# EAGLE design Due VGA Shield (EAGLE 6.1)
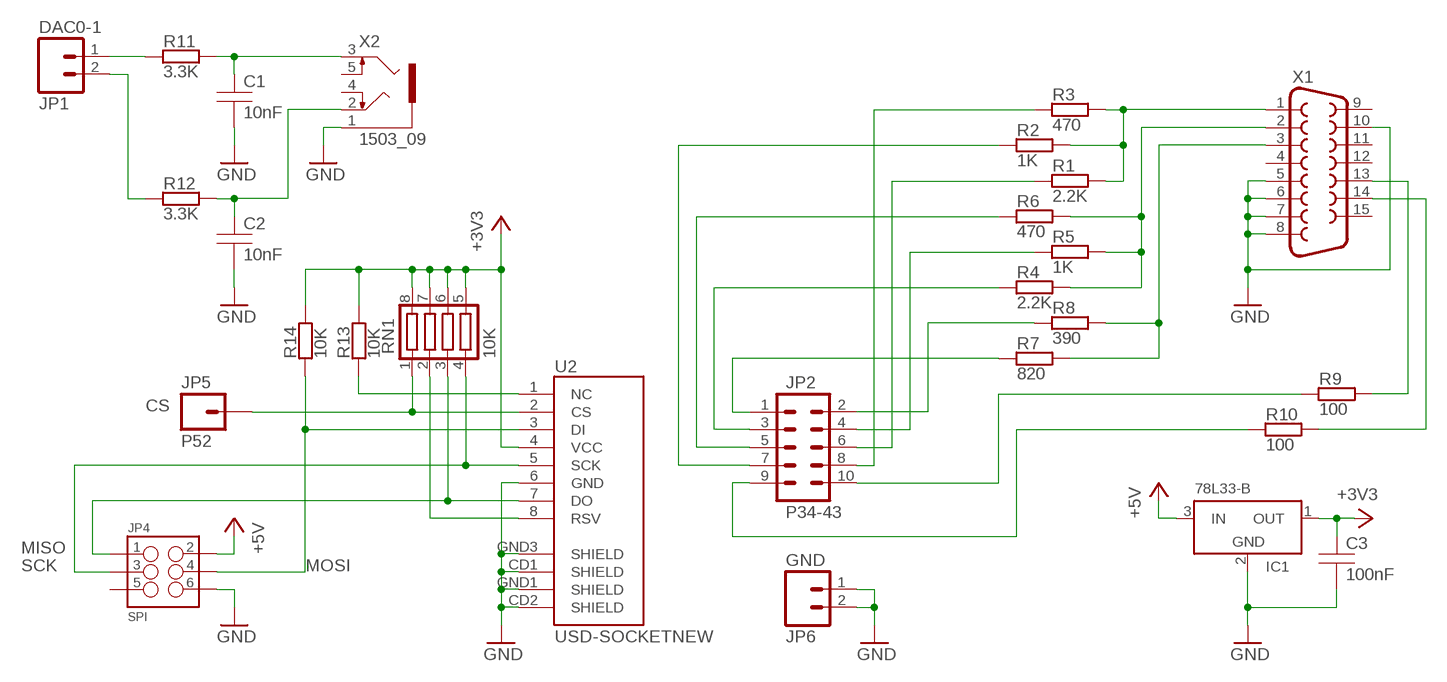
[diagram p0: schematic, sheet 1]

## Parts
C1  10nF  CAPACITOR_CERAM-SMD-2012  [SMD-2012]
C2  10nF  CAPACITOR_CERAM-SMD-2012  [SMD-2012]
C3  100nF  CAPACITOR_CERAM-SMD-2012  [SMD-2012]
IC1  78L33-B  [TO-92/M]
JP1  DAC0-1  M02PTH  [1X02]
JP2  P34-43  M05X2PTH  [AVR_ICSP]
JP4  SPI  M03X22X3_SILK_SM  [2X3]
JP5  P52  M01PTH  [1X01]
JP6  GND  M02PTH  [1X02]
R1  2.2K  RESISTENCIA-SMD-2012  [SMD-2012]
R2  1K  RESISTENCIA-SMD-2012  [SMD-2012]
R3  470  RESISTENCIA-SMD-2012  [SMD-2012]
R4  2.2K  RESISTENCIA-SMD-2012  [SMD-2012]
R5  1K  RESISTENCIA-SMD-2012  [SMD-2012]
R6  470  RESISTENCIA-SMD-2012  [SMD-2012]
R7  820  RESISTENCIA-SMD-2012  [SMD-2012]
R8  390  RESISTENCIA-SMD-2012  [SMD-2012]
R9  100  RESISTENCIA-SMD-2012  [SMD-2012]
R10  100  RESISTENCIA-SMD-2012  [SMD-2012]
R11  3.3K  RESISTENCIA-SMD-2012  [SMD-2012]
R12  3.3K  RESISTENCIA-SMD-2012  [SMD-2012]
R13  10K  RESISTENCIA-SMD-2012  [SMD-2012]
R14  10K  RESISTENCIA-SMD-2012  [SMD-2012]
RN1  10K  CTS742C083  [CTS742C083]
U2  USD-SOCKETNEW  [MICRO-SD-SOCKET-PP]
X1  F15HDH  [HDF15H]
X2  1503_09  [1503_09]

## Nets
+3V3: C3.P$1 IC1.1(OUT) R13.P$1 R14.P$1 RN1.5 RN1.6 RN1.7 RN1.8 U2.4(VCC)
+5V: IC1.3(IN) JP4.2
CS: JP5.1 RN1.1 U2.2(CS)
GND: C1.P$2 C2.P$2 C3.P$2 IC1.2(GND) JP4.6 JP6.1 JP6.2 U2.6(GND) U2.CD1(SHIELD) U2.CD2(SHIELD) U2.GND1(SHIELD) U2.GND3(SHIELD) X1.5 X1.6 X1.7 X1.8 X1.10 X2.1
MISO: JP4.1 RN1.3 U2.7(DO)
MOSI: JP4.4 R14.P$2 U2.3(DI)
N$1: R9.P$1 X1.13
N$2: R10.P$1 X1.14
N$3: R1.P$1 R2.P$1 R3.P$1 X1.1
N$4: R4.P$1 R5.P$1 R6.P$1 X1.2
N$5: R7.P$1 R8.P$1 X1.3
N$6: C1.P$1 R11.P$1 X2.3
N$7: C2.P$1 R12.P$1 X2.2
N$8: JP2.1 R7.P$2
N$9: JP2.2 R8.P$2
N$10: JP2.3 R4.P$2
N$11: JP2.4 R5.P$2
N$12: JP2.5 R6.P$2
N$13: JP2.6 R1.P$2
N$14: JP2.7 R2.P$2
N$15: JP2.8 R3.P$2
N$16: JP1.1 R11.P$2
N$17: JP1.2 R12.P$2
N$18: JP2.9 R10.P$2
N$19: JP2.10 R9.P$2
N$26: RN1.2 U2.8(RSV)
N$27: R13.P$2 U2.1(NC)
SCK: JP4.3 RN1.4 U2.5(SCK)
Unconnected: JP4.5 X1.4 X1.9 X1.11 X1.12 X1.15 X2.4 X2.5

## Library data of the parts
C1-C3 = Personal - Varios:CAPACITOR_CERAM
IC1 = Personal - Semiconductores:78L33
JP1 JP6 = SparkFun-Connectors:M02: Standard 2-pin 0.1" header. Use with - straight break away headers ( PRT-00116) - right angle break away headers (PRT-00553) - swiss pins (PRT-00743) - machine pins (PRT-00117) - female headers (PRT-00115) Molex polarized connector foot print use with: PRT-08233 with associated crimp pins and housings. 2.54_SCREWTERM for use with PRT-10571. 3.5mm Screw Terminal footprints for PRT-08084 5mm Screw Terminal footprints for use with PRT-08433
JP2 = SparkFun-Connectors:M05X2: Header 5x2 Standard 10-pin dual row 0.1" header. Commonly used with AVR-ISP. Use with Spark Fun Electronics SKU: PRT-00778
JP4 = SparkFun-Connectors:M03X2: 2x3 .1" header. Shrouded, with keying- CONN-10681 SMT- CONN-11415 Pogo pins- HW-11044
JP5 = SparkFun-Connectors:M01: Header 1 Standard 1-pin 0.1" header. Use with straight break away headers (SKU : PRT-00116), right angle break away headers (PRT-00553), swiss pins (PRT-00743), machine pins (PRT-00117), and female headers (PRT-00115).
R1-R14 = Personal - Varios:RESISTENCIA
RN1 = resistor-net:CTS742C083: Chip Resistor Array 4 Single Resistor Source: http://www.ctscorp.com/components/Datasheets/CTSChipArrayDs.pdf; OC_FARNELL: unknown; OC_NEWARK: unknown
U2 = SparkFun-Connectors:USD-SOCKET: microSD Socket Push-push type uSD socket. Schematic element and footprint production proven. Spark Fun Electronics SKU : PRT-00127. tDoc lines correctly indicate media card edge positions when inserting (unlocked, locked, depressed).
X1 = con-subd:F15: SUB-D; OC_FARNELL: unknown; OC_NEWARK: unknown
X2 = con-lumberg:1503_09: Jack connectors according to JISC 6560, 3.5 mm Klinkeneinbaukupplung nach JISC 6560, 3,5 mm, 3-polig/ stereo, abgewinkelte Ausführung, mit 2 Öffnern und Lötaugen, für Leiterplatten Rückseitenmontage Source: http://www.lumberg.com/Produkte/PDFs/1503_09.pdf; OC_FARNELL: 1243244; OC_NEWARK: unknown

## Board
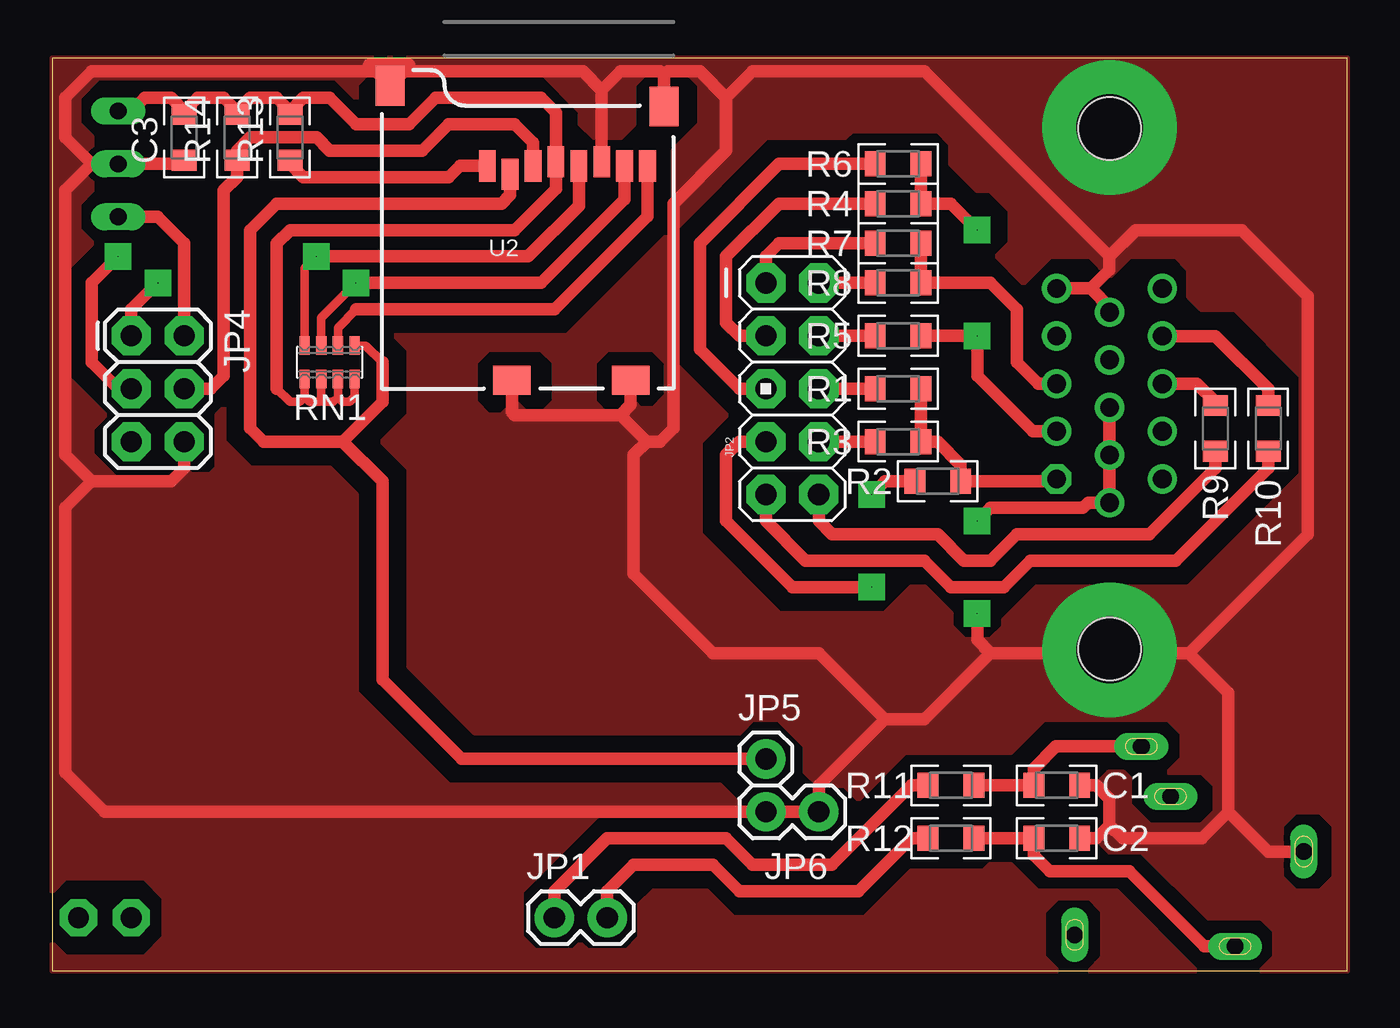
[diagram p1: board, top side]
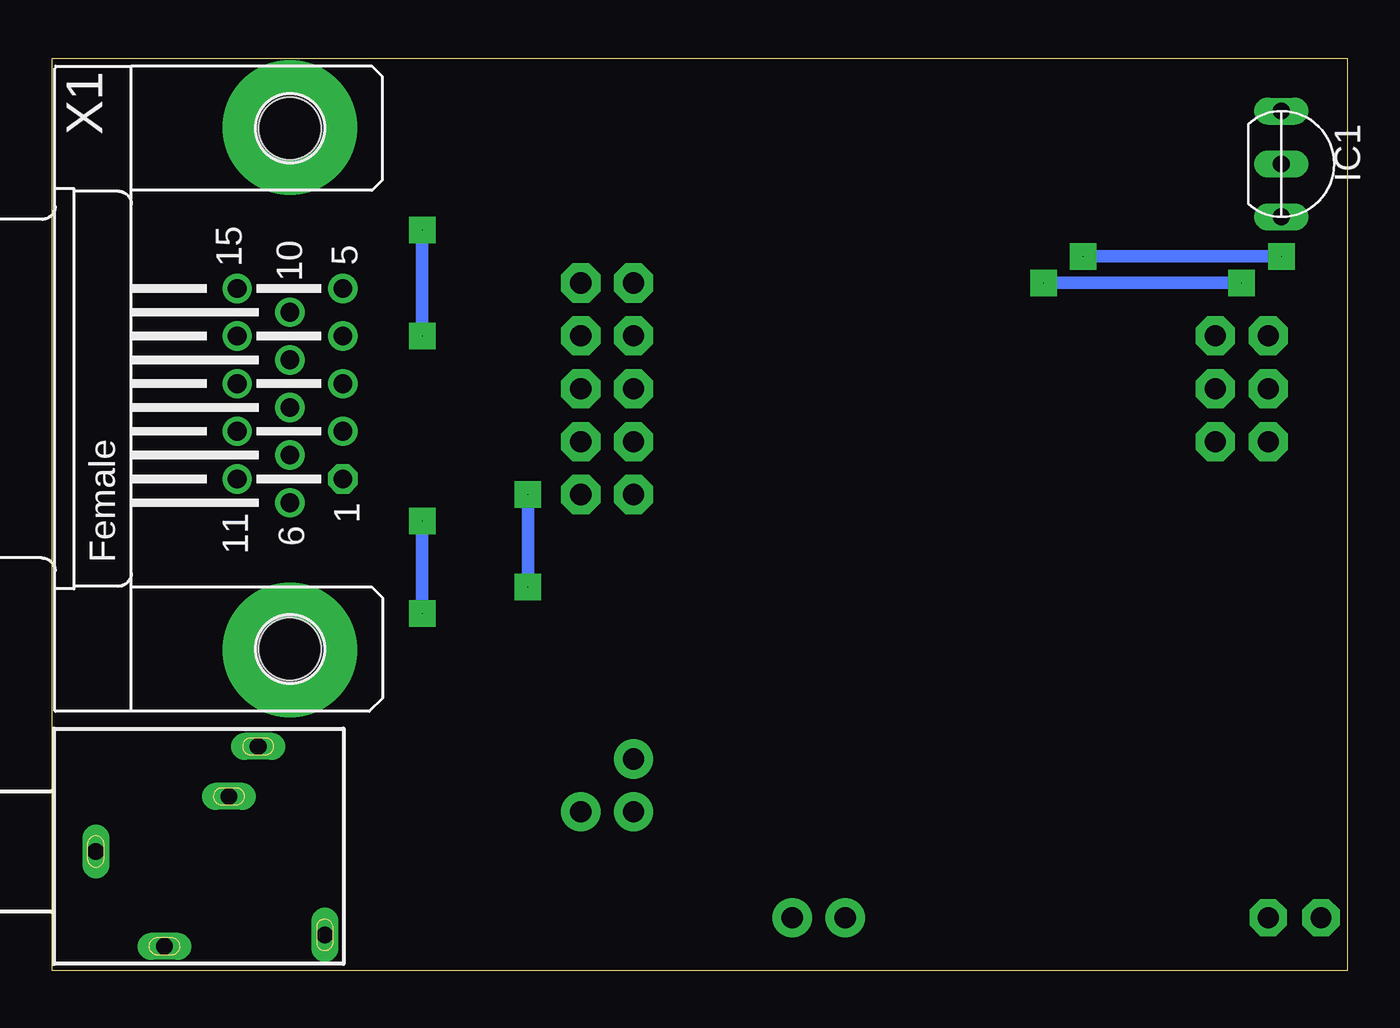
[diagram p2: board, bottom side, seen from below]

Size 62.23 x 43.81 mm. Coordinates in mm from the lower left corner, seen from the top.
Outline: 0,0 62.23,0 62.23,43.81 0,43.81 0,0
Copper layers (1*16): Top 0.035mm / dielectric 1.5mm / Bottom 0.035mm
Design rules: minimum track width 16mil, minimum drill 1mil, track to track 11mil, track to pad 11mil, pad to pad 11mil, via to via 11mil, smd to smd 11mil, copper to edge 0mil, drill to drill 8mil, minimum pad ring 10mil, minimum via ring 8mil, stop-mask expansion 4mil, vias tented up to drill 0mil, thermal gap 12mil

### Footprints (pad centres in the part's own frame; a part is rotated, then mirrored left to right if it is on the bottom)
SMD-2012 = smd 1 x 1.2: P$1 1.1,0; P$2 -1.1,0
TO-92/M = drill 0.8 long: 1 -2.54,0; 2 0,0; 3 2.54,0
1X02 = drill 1.016 pad 1.88: 1 0,0; 2 2.54,0
AVR_ICSP = drill 1.016 pad 1.88 octagon: 1 -1.27,5.08; 2 1.27,5.08; 3 -1.27,2.54; 4 1.27,2.54; 5 -1.27,0; 6 1.27,0; 7 -1.27,-2.54; 8 1.27,-2.54; 9 -1.27,-5.08; 10 1.27,-5.08
2X3 = drill 1.016 pad 1.88 octagon: 1 0,0; 2 0,2.54; 3 2.54,0; 4 2.54,2.54; 5 5.08,0; 6 5.08,2.54
1X01 = drill 1.016 pad 1.88: 1 0,0
CTS742C083 = smd 0.5 x 0.9: 1 -1.2,-0.8; 2 -0.4,-0.8; 3 0.4,-0.8; 4 1.2,-0.8; 5 1.2,0.8; 6 0.4,0.8; 7 -0.4,0.8; 8 -1.2,0.8
MICRO-SD-SOCKET-PP = smd 0.8 x 1.5: 1 -8.94,10.7; 2 -7.84,10.3; 3 -6.74,10.7; 4 -5.64,10.9; 5 -4.54,10.7; 6 -3.44,10.9; 7 -2.34,10.7; 8 -1.24,10.7 | smd 1.8 x 1.4: CD1 -2.05,0.4; CD2 -7.75,0.4 | smd 1.4 x 1.9: GND1 -13.6,14.55; GND3 -0.45,13.55
HDF15H = drill 0.9 octagon: 1 4.329,2.54 | drill 0.9: 2 2.043,2.54; 3 -0.243,2.54; 4 -2.529,2.54; 5 -4.815,2.54; 6 5.472,0; 7 3.186,0; 8 0.9,0; 9 -1.386,0; 10 -3.672,0; 11 4.329,-2.54; 12 2.043,-2.54; 13 -0.243,-2.54; 14 -2.529,-2.54; 15 -4.815,-2.54 | hole 3: -12.5,0; 12.5,0
1503_09 = drill 0.8 pad 1.2 long: 1 0,-2.1; 2 -4.55,-5.4; 3 5.05,-9.9; 4 -4,-13.1; 5 2.65,-8.5

### Placement (x,y rotation side)
C1  48.26,8.89 180 top
C2  48.26,6.35 180 top
C3  6.35,40.01 90 top
IC1  3.17,38.73 270 bottom
JP1  24.13,2.54 0 top
JP2  35.56,27.94 0 top
JP4  3.81,30.48 270 top
JP5  34.29,10.16 0 top
JP6  34.29,7.62 0 top
R1  40.64,27.94 0 top
R2  42.55,23.5 0 top
R3  40.64,25.4 0 top
R4  40.64,36.83 0 top
R5  40.64,30.48 0 top
R6  40.64,38.73 0 top
R7  40.64,34.92 0 top
R8  40.64,33.02 0 top
R9  55.88,26.04 90 top
R10  58.42,26.04 90 top
R11  43.18,8.89 0 top
R12  43.18,6.35 0 top
R13  11.43,40.01 90 top
R14  8.89,40.01 90 top
RN1  13.34,29.21 180 top
U2  29.84,27.94 0 top
X1  50.8,27.94 270 bottom
X2  62.23,5.71 90 bottom

### Tracks (layer width: path | path; a pad name or v marks a point on that pad's centre or on a via)
+3V3
  Top 0.406: RN1.8 14.54,27.55 14.29,27.3 13.97,27.3 13.73,27.54 | RN1.7 13.73,27.54 | RN1.6 12.94,27.39 | 12.94,27.39 13.02,27.3 13.5,27.3 13.73,27.54 | RN1.5 12.13,27.55 | 12.13,27.55 12.38,27.3 12.85,27.3 12.94,27.39 | 10.79,27.94 11.43,27.3 11.89,27.3 12.13,27.55
  Top 0.61: 10.79,27.94 10.79,34.92 11.43,35.56 22.23,35.56 24.2,37.54 U2.4 24.2,41.2 23.5,41.91 18.41,41.91 17.14,40.64 14.61,40.64 13.34,41.91 12.06,41.91 11.43,41.27 | R13.P$1 11.43,41.27 | 11.43,41.27 10.79,41.91 9.53,41.91 8.89,41.27 | 8.89,41.27 8.26,41.91 6.99,41.91 6.35,41.27 | 8.89,41.27 R14.P$1 | C3.P$1 6.35,41.27 | IC1.1 3.81,41.27 4.45,41.91 5.71,41.91 6.35,41.27
+5V
  Top 0.61: IC1.3 5.08,36.2 6.35,34.92 JP4.2
CS
  Top 0.406: RN1.1 15.07,30.01 15.88,29.21
  Top 0.61: JP5.1 19.68,10.16 15.88,13.97 15.88,23.5 13.97,25.4 | 13.97,25.4 10.16,25.4 9.53,26.04 9.53,35.56 10.79,36.83 21.59,36.83 22,37.24 U2.2 | 13.97,25.4 15.88,27.3 15.88,29.21
GND  (via drill 0.03 pad 1.27, 3.2 pad 6.45)
  Top 0.61: X1.5 49.9,32.76 | X1.8 X1.7 X1.6 49.77,22.47 49.53,22.23 45.09,22.23 v44.45,21.59 | v44.45,17.14 44.45,15.88 45.09,15.24 | 45.09,15.24 54.61,15.24 | 54.61,15.24 60.33,20.95 60.33,32.38 57.15,35.56 52.07,35.56 50.8,34.29 | 50.8,34.29 50.8,33.66 49.9,32.76 | X1.10 50.8,31.86 49.9,32.76 | 54.61,15.24 56.52,13.34 56.52,7.62 | 56.52,7.62 55.24,6.35 51.44,6.35 50.8,6.99 | X2.1 58.42,5.71 56.52,7.62 | 40.01,12.06 36.83,8.89 JP6.2 JP6.1 2.54,7.62 0.64,9.53 0.64,22.23 1.91,23.5 | 40.01,12.06 41.91,12.06 45.09,15.24 | JP4.6 6.35,24.13 5.71,23.5 1.91,23.5 | 1.91,23.5 0.64,24.77 0.64,37.47 1.91,38.73 | 15.24,43.18 15.55,43.18 U2.GND1 16.93,43.18 17.14,43.18 | 15.24,43.18 1.91,43.18 0.64,41.91 0.64,40.01 1.91,38.73 | 1.91,38.73 IC1.2 6.18,38.73 C3.P$2 | U2.6 26.41,42.28 | 26.41,42.28 27.3,43.18 29.21,43.18 29.39,42.99 | 17.14,43.18 25.5,43.18 26.41,42.28 | U2.CD2 22.09,26.8 22.23,26.67 27.3,26.67 | U2.CD1 27.8,27.16 27.3,26.67 | 40.01,12.06 36.83,15.24 31.75,15.24 27.94,19.05 27.94,24.77 28.57,25.4 | 28.57,25.4 27.3,26.67 | 50.8,34.29 41.91,43.18 33.66,43.18 32.38,41.91 | 32.38,41.91 31.11,43.18 29.58,43.18 29.39,42.99 | U2.GND3 29.39,42.99 | 32.38,41.91 32.38,39.37 29.84,36.83 29.84,26.04 29.21,25.4 28.57,25.4 | C2.P$2 50.16,6.35 50.8,6.99 | C1.P$2 50.16,8.89 50.8,8.26 50.8,6.99 | 15.24,43.18 15.24,43.5 17.14,43.5 17.14,43.18
  Bottom 0.61: v44.45,21.59 v44.45,17.14
  other vias: 50.8,15.4 50.8,40.48
  pour Top: 60.01,23.81 54.61,18.41 47.31,18.41 45.72,16.83 45.72,16.51 45.09,15.88 43.81,15.88 43.18,16.51 43.18,17.14 41.91,18.41 41.27,18.41 40.01,17.14 34.92,17.14 31.11,20.95 31.11,25.4 32.38,26.67 29.53,29.53 29.53,27.62 28.89,26.99 28.26,26.99 27.94,27.3 27.3,26.67 26.67,26.67 26.04,27.3 26.04,29.21 26.67,29.84 23.5,29.84 24.13,29.21 24.13,27.3 23.5,26.67 22.86,26.67 22.23,27.3 21.59,26.67 20.95,26.67 20.32,27.3 20.32,29.21 20.95,29.84 17.14,29.84 17.14,26.67 15.88,25.4 17.14,24.13 17.14,14.61 20.32,11.43 33.02,11.43 33.66,12.06 34.92,12.06 36.2,10.79 36.2,9.53 36.83,8.89 38.1,8.89 38.73,8.26 40.96,10.48 46.04,10.48 47.62,12.06 53.66,12.06 54.29,11.43 54.29,10.16 53.66,9.53 55.24,9.53 55.88,8.89 55.88,7.62 55.24,6.99 52.7,6.99 51.75,7.94 51.75,9.21 51.44,9.53 50.8,9.53 50.16,8.89 50.8,8.26 50.8,6.99 50.16,6.35 50.8,5.71 52.39,5.71 55.56,2.54 58.1,2.54 58.74,1.91 58.74,0.64 58.1,0 62.23,0 62.23,3.81 59.69,3.81 59.05,4.45 59.05,6.99 59.69,7.62 62.23,7.62 62.23,43.81 0,43.81 0,3.81 0.64,4.45 4.45,4.45 5.4,3.49 5.4,1.59 4.45,0.64 0.64,0.64 0,1.27 0,0 48.26,0 47.62,0.64 47.62,2.86 48.26,3.49 49.85,3.49 50.48,2.86 50.48,0.64 49.85,0 54.93,0 51.12,3.81 47.31,3.81 46.04,5.08 45.09,5.08 44.77,4.76 41.27,4.76 39.05,2.54 32.7,2.54 31.43,3.81 28.89,3.81 28.26,3.17 28.26,1.59 27.62,0.95 25.72,0.95 25.4,1.27 25.08,0.95 23.18,0.95 22.54,1.59 22.54,3.81 26.35,7.62 33.34,7.62 32.07,8.89 19.05,8.89 14.61,13.34 14.61,22.86 13.34,24.13 9.53,24.13 8.26,25.4 8.26,26.99 7.94,26.67 7.94,24.13 7.62,23.81 6.67,23.81 6.35,24.13 5.71,23.5 3.17,23.5 1.91,24.77 1.91,26.04 2.54,26.67 0.64,28.57 0.64,33.66 1.91,34.92 1.27,35.56 1.27,36.83 1.91,37.47 1.91,40.01 1.27,40.64 1.27,41.91 2.22,42.86 13.65,42.86 14.61,41.91 14.61,42.55 15.24,43.18 23.5,43.18 25.4,41.27 25.4,40.64 26.04,40.01 27.3,40.01 27.94,40.64 27.94,42.55 28.57,43.18 30.48,43.18 31.11,42.55 31.11,40.64 29.84,39.37 29.84,35.56 34.29,40.01 38.1,40.01 38.42,40.32 42.55,40.32 43.18,39.69 43.18,38.73 44.45,37.47 45.09,37.47 46.04,36.51 46.04,34.92 45.4,34.29 46.67,33.02 47.94,34.29 49.85,34.29 50.8,33.34 51.75,34.29 53.98,34.29 54.61,33.66 54.61,32.38 55.24,31.75 56.83,31.75 60.01,28.57
  pour Top: 60.96,7.62 61.59,6.99 61.59,4.45 60.96,3.81 62.23,3.81 62.23,7.62
  pour Top: 16.51,30.48 24.77,30.48 29.53,35.24 29.53,29.21 28.89,29.84 17.14,29.84
MISO  (via drill 0.03 pad 1.27)
  Top 0.406: RN1.3 12.94,31.35 v14.61,33.02
  Top 0.61: JP4.1 3.81,31.75 v5.08,33.02 | v14.61,33.02 23.5,33.02 27.5,37.03 U2.7
  Bottom 0.61: v5.08,33.02 v14.61,33.02
MOSI
  Top 0.61: U2.3 23.11,39.76 22.23,40.64 19.05,40.64 17.78,39.37 13.34,39.37 12.7,40.01 9.53,40.01 8.89,39.37 R14.P$2 8.89,38.1 8.26,37.47 8.26,28.57 7.62,27.94 JP4.4
N$1
  Top 0.61: X1.13 55,28.18 55.88,27.3 R9.P$1
N$2
  Top 0.61: X1.14 55.89,30.47 58.42,27.94 R10.P$1
N$3
  Top 0.61: R1.P$1 R3.P$1 42.55,25.4 43.65,24.3 R2.P$1 48.14,23.5 X1.1
N$4  (via drill 0.03 pad 1.27)
  Top 0.61: R6.P$1 R4.P$1 43.18,36.83 v44.45,35.56 | R5.P$1 v44.45,30.48 44.45,28.57 47.13,25.9 X1.2
  Bottom 0.61: v44.45,35.56 v44.45,30.48
N$5
  Top 0.61: R7.P$1 R8.P$1 45.09,33.02 46.35,31.75 46.35,29.21 47.38,28.18 X1.3
N$6
  Top 0.61: X2.3 48.23,10.77 47.16,9.7 C1.P$1 R11.P$1
N$7
  Top 0.61: X2.2 55.35,1.17 51.75,4.76 47.94,4.76 47.16,5.54 C2.P$1 R12.P$1
N$8
  Top 0.61: JP2.1 34.29,34.29 34.92,34.92 R7.P$2
N$9
  Top 0.61: JP2.2 R8.P$2
N$10
  Top 0.61: R4.P$2 34.92,36.83 32.38,34.29 32.38,31.11 33.02,30.48 JP2.3
N$11
  Top 0.61: JP2.4 R5.P$2
N$12
  Top 0.61: R6.P$2 34.92,38.73 31.11,34.92 31.11,29.84 33.02,27.94 JP2.5
N$13
  Top 0.61: JP2.6 R1.P$2
N$14  (via drill 0.03 pad 1.27)
  Top 0.61: JP2.7 33.02,25.4 32.38,24.77 32.38,21.59 35.56,18.41 v39.37,18.41 | v39.37,22.86 40.01,23.5 R2.P$2
  Bottom 0.61: v39.37,18.41 v39.37,22.86
N$15
  Top 0.61: JP2.8 R3.P$2
N$16
  Top 0.61: R11.P$2 41.27,8.89 37.47,5.08 33.66,5.08 32.38,6.35 26.67,6.35 24.13,3.81 JP1.1
N$17
  Top 0.61: R12.P$2 41.27,6.35 38.73,3.81 33.02,3.81 31.75,5.08 27.94,5.08 26.67,3.81 JP1.2
N$18
  Top 0.61: JP2.9 34.29,21.59 36.2,19.68 41.91,19.68 43.18,18.41 45.72,18.41 46.99,19.68 53.98,19.68 58.42,24.13 R10.P$2
N$19
  Top 0.61: JP2.10 36.83,21.59 37.47,20.95 42.55,20.95 43.81,19.68 45.09,19.68 46.35,20.95 52.7,20.95 55.88,24.13 R9.P$2
N$24  (via drill 1 pad 1.78)
  other vias: 1.27,2.54
N$25  (via drill 1 pad 1.78)
  other vias: 3.81,2.54
N$26
  Top 0.406: RN1.2 13.73,30.88 14.61,31.75
  Top 0.61: U2.8 28.61,36.23 24.13,31.75 14.61,31.75
N$27
  Top 0.61: U2.1 19.59,38.64 19.05,38.1 12.06,38.1 11.43,38.73 R13.P$2
SCK  (via drill 0.03 pad 1.27)
  Top 0.406: RN1.4 12.13,33.73 v12.7,34.29
  Top 0.61: JP4.3 3.17,27.94 1.91,29.21 1.91,33.02 v3.17,34.29 | v12.7,34.29 22.86,34.29 25.3,36.73 U2.5
  Bottom 0.61: v3.17,34.29 v12.7,34.29